# EAGLE design ball-r1 (EAGLE 5.12)
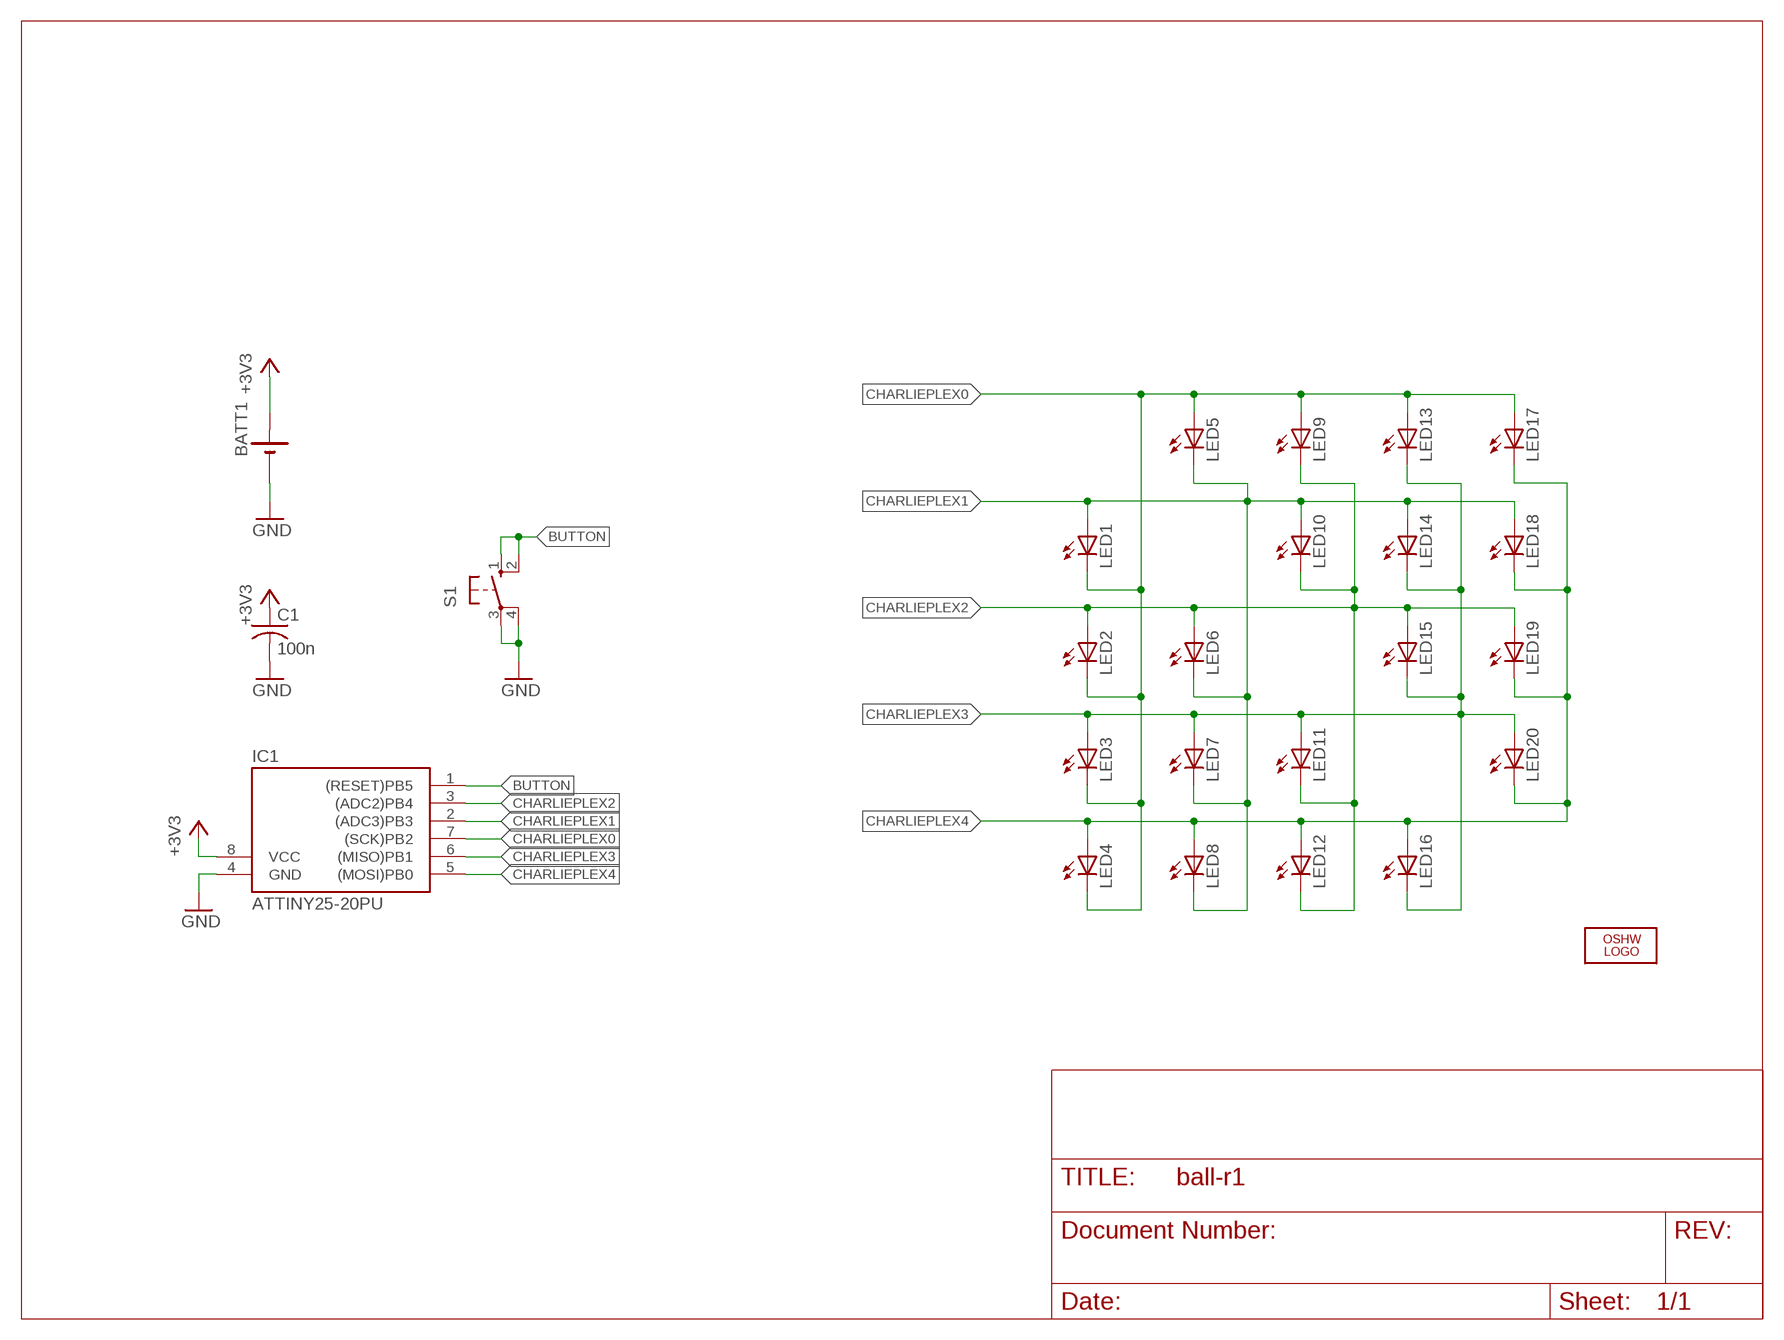
[diagram p0: schematic, sheet 1]

## Parts
BATT1  2032SMD  [2032SMD]
C1  100n  C-US050-025X075  [C050-025X075]
IC1  ATTINY25-20PU  TINY138P3  [DIL08]
LED1  LED3MM  [LED3MM]
LED2  LED3MM  [LED3MM]
LED3  LED3MM  [LED3MM]
LED4  LED3MM  [LED3MM]
LED5  LED3MM  [LED3MM]
LED6  LED3MM  [LED3MM]
LED7  LED3MM  [LED3MM]
LED8  LED3MM  [LED3MM]
LED9  LED3MM  [LED3MM]
LED10  LED3MM  [LED3MM]
LED11  LED3MM  [LED3MM]
LED12  LED3MM  [LED3MM]
LED13  LED3MM  [LED3MM]
LED14  LED3MM  [LED3MM]
LED15  LED3MM  [LED3MM]
LED16  LED3MM  [LED3MM]
LED17  LED3MM  [LED3MM]
LED18  LED3MM  [LED3MM]
LED19  LED3MM  [LED3MM]
LED20  LED3MM  [LED3MM]
LOGO1  OSHW_LOGO_FILLX0100-NT  [OSHW_FILLX100_NOTEXT]
S1  10-XX  [B3F-10XX]

## Nets
+3V3: BATT1.+ C1.1 IC1.8(VCC)
BUTTON: IC1.1((RESET)PB5) S1.1(S) S1.2(S1)
CHARLIEPLEX0: IC1.7((SCK)PB2) LED1.K(C) LED2.K(C) LED3.K(C) LED4.K(C) LED5.A LED9.A LED13.A LED17.A
CHARLIEPLEX1: IC1.2((ADC3)PB3) LED1.A LED5.K(C) LED6.K(C) LED7.K(C) LED8.K(C) LED10.A LED14.A LED18.A
CHARLIEPLEX2: IC1.3((ADC2)PB4) LED2.A LED6.A LED9.K(C) LED10.K(C) LED11.K(C) LED12.K(C) LED15.A LED19.A
CHARLIEPLEX3: IC1.6((MISO)PB1) LED3.A LED7.A LED11.A LED13.K(C) LED14.K(C) LED15.K(C) LED16.K(C) LED20.A
CHARLIEPLEX4: IC1.5((MOSI)PB0) LED4.A LED8.A LED12.A LED16.A LED17.K(C) LED18.K(C) LED19.K(C) LED20.K(C)
GND: BATT1.- C1.2 IC1.4(GND) S1.3(P) S1.4(P1)

## Library data of the parts
BATT1 = rbg-4ucon-battery:2032SMD
C1 = rcl:C-US: CAPACITOR, American symbol
IC1 = avr-5:TINY13*
LED1-LED20 = led:LED: LED OSRAM: - CHIPLED LG R971, LG N971, LY N971, LG Q971, LY Q971, LO R971, LY R971 LH N974, LH R974 LS Q976, LO Q976, LY Q976 LO Q996 - Hyper CHIPLED LW Q18S LB Q993, LB Q99A, LB R99A - SideLED LS A670, LO A670, LY A670, LG A670, LP A670 LB A673, LV A673, LT A673, LW A673 LH A674 LY A675 LS A676, LA A676, LO A676, LY A676, LW A676 LS A679, LY A679, LG A679 - Hyper Micro SIDELED® LS Y876, LA Y876, LO Y876, LY Y876 LT Y87S - SmartLED LW L88C, LW L88S LB L89C, LB L89S, LG L890 LS L89K, LO L89K, LY L89K LS L896, LA L896, LO L896, LY L896 - TOPLED LS T670, LO T670, LY T670, LG T670, LP T670 LSG T670, LSP T670, LSY T670, LOP T670, LYG T670 LG T671, LOG T671, LSG T671 LB T673, LV T673, LT T673, LW T673 LH T674 LS T676, LA T676, LO T676, LY T676, LB T676, LH T676, LSB T676, LW T676 LB T67C, LV T67C, LT T67C, LS T67K, LO T67K, LY T67K, LW E67C LS E67B, LA E67B, LO E67B, LY E67B, LB E67C, LV E67C, LT E67C LW T67C LS T679, LY T679, LG T679 LS T770, LO T770, LY T770, LG T770, LP T770 LB T773, LV T773, LT T773, LW T773 LH T774 LS E675, LA E675, LY E675, LS T675 LS T776, LA T776, LO T776, LY T776, LB T776 LHGB T686 LT T68C, LB T68C - Hyper Mini TOPLED® LB M676 - Mini TOPLED Santana® LG M470 LS M47K, LO M47K, LY M47K Source: http://www.osram.convergy.de LUXEON: - LUMILED® LXK2-PW12-R00, LXK2-PW12-S00, LXK2-PW14-U00, LXK2-PW14-V00 LXK2-PM12-R00, LXK2-PM12-S00, LXK2-PM14-U00 LXK2-PE12-Q00, LXK2-PE12-R00, LXK2-PE12-S00, LXK2-PE14-T00, LXK2-PE14-U00 LXK2-PB12-K00, LXK2-PB12-L00, LXK2-PB12-M00, LXK2-PB14-N00, LXK2-PB14-P00, LXK2-PB14-Q00 LXK2-PR12-L00, LXK2-PR12-M00, LXK2-PR14-Q00, LXK2-PR14-R00 LXK2-PD12-Q00, LXK2-PD12-R00, LXK2-PD12-S00 LXK2-PH12-R00, LXK2-PH12-S00 LXK2-PL12-P00, LXK2-PL12-Q00, LXK2-PL12-R00 Source: www.luxeon.com KINGBRIGHT: KA-3528ASYC Source: www.kingbright.com
LOGO1 = ohw-logo:OSHW_LOGO_FILL
S1 = rbg-generic-tact-switch:10-XX: OMRON SWITCH

## Board
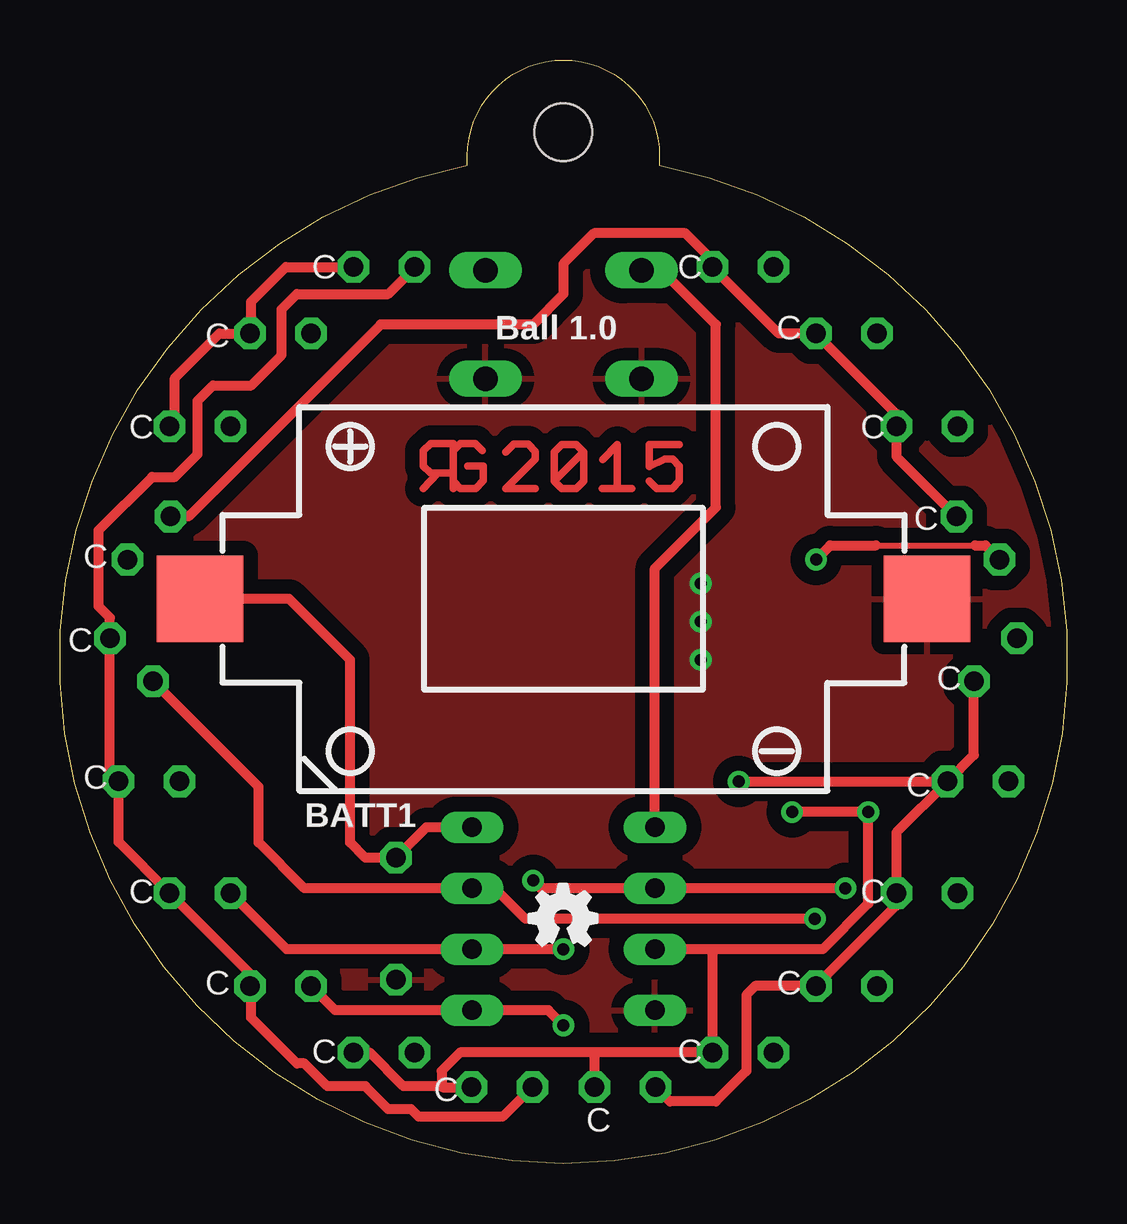
[diagram p1: board, top side]
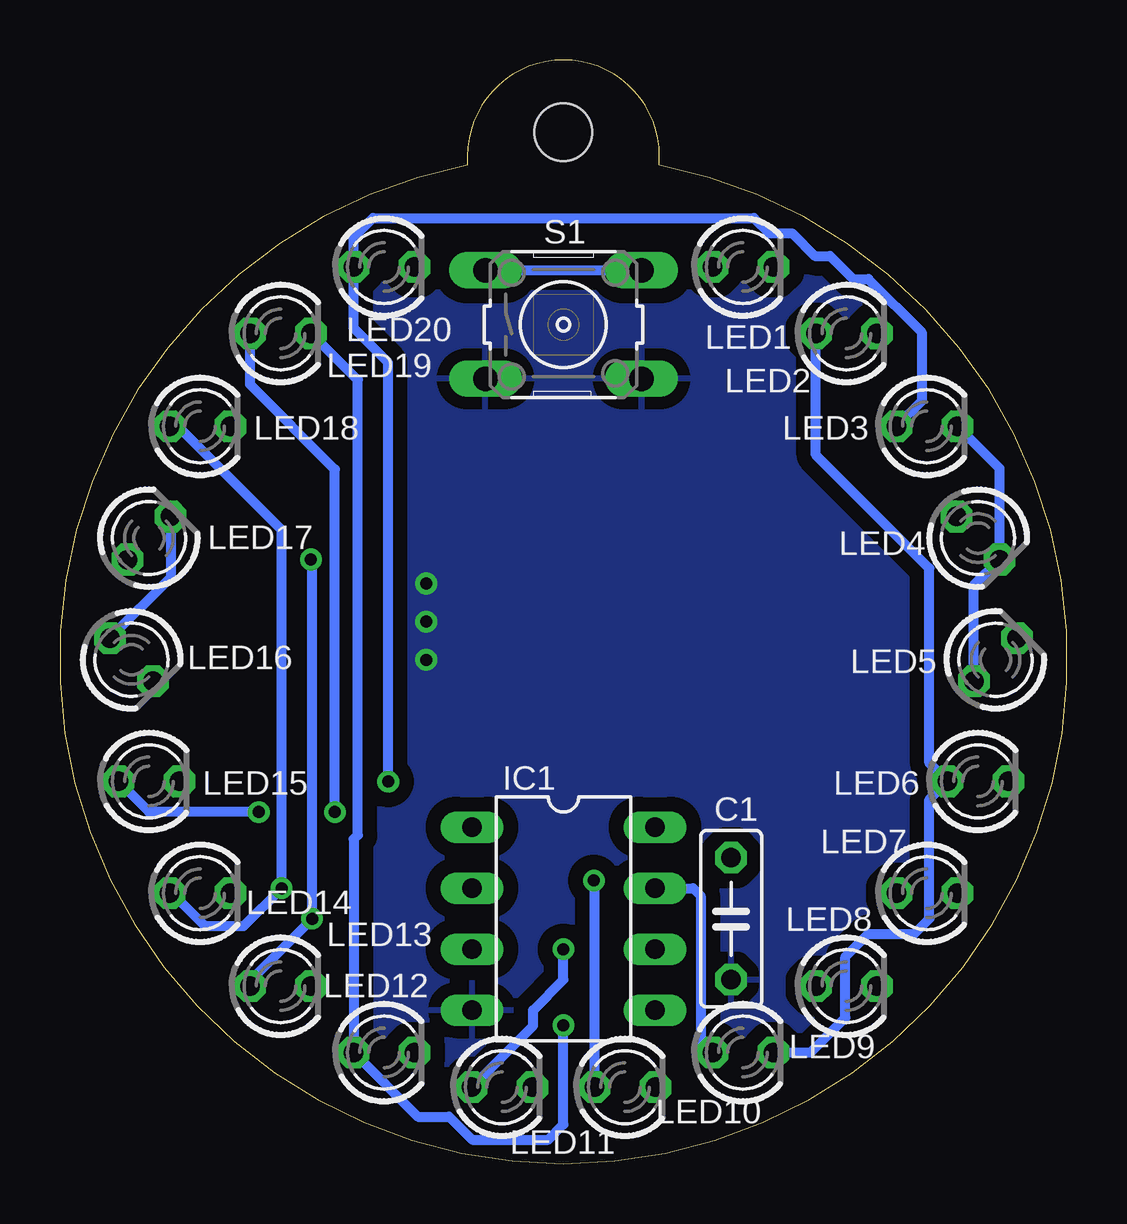
[diagram p2: board, bottom side, seen from below]

Size 41.96 x 46 mm. Coordinates in mm from the lower left corner, seen from the top.
Outline: 24.98,41.62 arc-338 16.98,41.62 16.98,42 arc-90 20.98,46 arc-90 24.98,42 24.98,41.62
Copper layers (1*16): Top 0.035mm / dielectric 1.5mm / Bottom 0.035mm
Design rules "default *": minimum track width 10mil, minimum drill 0.5mm, track to track 10mil, track to pad 10mil, pad to pad 10mil, via to via 10mil, smd to smd 10mil, copper to edge 10mil, drill to drill 8mil, minimum pad ring 10mil, minimum via ring 8mil, stop-mask expansion 4mil, vias tented up to drill 20mil, thermal gap 20mil
Holes 2.4 mm at 20.98,43

### Footprints (pad centres in the part's own frame; a part is rotated, then mirrored left to right if it is on the bottom)
2032SMD = smd 3.6 x 3.6: + -15.15,0; - 15.15,0
C050-025X075 = drill 0.813 octagon: 1 -2.54,0; 2 2.54,0
DIL08 = drill 0.813 long: 1 -3.81,-3.81; 2 -1.27,-3.81; 3 1.27,-3.81; 4 3.81,-3.81; 5 3.81,3.81; 6 1.27,3.81; 7 -1.27,3.81; 8 -3.81,3.81
LED3MM = drill 0.813 octagon: A -1.27,0; K 1.27,0
B3F-10XX = drill 1.016 long: 1 -3.251,2.261; 2 3.251,2.261; 3 -3.251,-2.261; 4 3.251,-2.261

### Placement (x,y rotation side)
BATT1  20.98,23.54 0 top
C1  13.99,10.21 270 bottom
IC1  20.98,10.21 270 bottom
LED1  13.5,37.37 0 bottom
LED2  9.19,34.6 0 bottom
LED3  5.84,30.73 0 bottom
LED4  3.71,26.07 315 bottom
LED5  2.98,21 45 bottom
LED6  3.71,15.93 0 bottom
LED7  5.84,11.27 0 bottom
LED8  9.19,7.4 0 bottom
LED9  13.5,4.63 0 bottom
LED10  18.42,3.18 0 bottom
LED11  23.54,3.18 0 bottom
LED12  28.46,4.63 0 bottom
LED13  32.77,7.4 0 bottom
LED14  36.12,11.27 0 bottom
LED15  38.25,15.93 0 bottom
LED16  38.98,21 315 bottom
LED17  38.25,26.07 45 bottom
LED18  36.12,30.73 0 bottom
LED19  32.77,34.6 0 bottom
LED20  28.46,37.37 0 bottom
LOGO1  19.55,9.09 0 top
S1  20.98,34.97 0 bottom
U$2  [RGLOGO_SMALL_2015]  16.53,27.99 0 top

### Tracks (layer width: path | path; a pad name or v marks a point on that pad's centre or on a via)
+3V3
  Top 0.406: IC1.8 15.26,14.02 C1.1 12.72,12.75 12.09,13.38 12.09,21 9.55,23.54 BATT1.+
BUTTON
  Top 0.406: IC1.1 24.79,24.81 27.33,27.35 27.33,34.97 24.79,37.51 24.51,37.51 S1.1
  Bottom 0.406: S1.1 S1.2
CHARLIEPLEX0  (via drill 0.5)
  Top 0.254: 34,25.76 38.12,25.76
  Top 0.406: LED5.A 8.28,15.7 8.28,13.38 10.18,11.48 IC1.7 18.12,11.48 19.39,10.21 v31.46,10.21 | LED1.K 9.41,37.37 7.96,35.92 7.96,34.64 LED2.K 6.64,34.6 4.79,32.75 4.79,30.95 LED3.K | v31.5,25.17 32.09,25.76 34,25.76 | LED17.A 38.56,25.76 38.12,25.76
  Bottom 0.406: LED3.K 2.81,28.98 LED4.K 3.88,24.11 LED5.A | IC1.7 15.58,11.48 15.26,11.16 15.26,5.12 LED9.A | LED13.A 34.04,7.63 v31.46,10.21 31.46,25.13 v31.5,25.17
CHARLIEPLEX1  (via drill 0.5)
  Top 0.406: LED10.A 19.67,3.18 18.44,1.95 14.95,1.95 14.63,2.27 13.68,2.27 12.72,3.22 11.14,3.22 10.18,4.17 9.87,4.17 7.96,6.08 7.96,7.36 LED8.K 7.92,7.91 LED7.K 2.44,13.4 LED6.K 2.08,16.29 LED5.K 2.08,22.75 1.61,23.22 1.61,26.4 3.83,28.62 4.79,28.62 5.74,29.57 5.74,31.8 6.37,32.43 7.96,32.43 9.23,33.7 9.23,35.61 9.87,36.24 13.68,36.24 14.77,37.34 LED1.A | v19.71,11.79 20.03,11.48 20.34,11.48 IC1.2 v32.73,11.48
  Bottom 0.406: LED10.A 19.69,11.77 v19.71,11.79 | LED14.A 37.28,11.27 35.9,9.89 34.31,9.89 v32.73,11.48 32.73,26.4 37.06,30.73 LED18.A
CHARLIEPLEX2  (via drill 0.5)
  Top 0.406: 22.25,4.63 LED12.K 27.19,8.79 27.33,8.94 | 22.25,4.63 16.67,4.63 15.9,3.86 15.9,3.22 | LED10.K 15.94,3.18 15.9,3.22 | LED11.K 22.27,4.61 22.25,4.63 | LED9.K 12.9,4.63 14.31,3.22 15.9,3.22 | v30.5,14.65 v33.68,14.65 33.68,10.84 31.77,8.94 27.33,8.94 | 27.33,8.94 IC1.3
  Bottom 0.406: LED9.K 10.68,4.63 9.23,6.08 9.23,8.62 8.28,9.57 6.37,9.57 5.74,10.21 5.74,15.17 LED6.A 5.74,16.69 5.74,24.81 10.46,29.53 LED2.A | v33.68,14.65 38.24,14.65 LED15.A | LED19.A 34.04,32.47 30.5,28.94 v30.5,14.65
CHARLIEPLEX3  (via drill 0.5)
  Top 0.406: LED16.K 38.08,17.03 LED15.K | LED15.K 34.85,13.8 LED14.K 34.85,10.75 LED13.K 28.97,7.4 28.6,7.03 28.6,3.86 27.33,2.59 25.41,2.59 LED11.A | LED7.A 9.44,8.94 IC1.6 v20.98,8.94 | v28.28,15.92 LED15.K
  Bottom 0.406: LED3.A 6.06,31.78 6.06,34.65 8.28,36.88 8.91,36.88 9.87,37.83 10.5,37.83 11.45,38.78 12.41,38.78 13.04,39.42 28.92,39.42 29.73,38.61 LED20.A 29.73,34.83 28.28,33.38 v28.28,15.92 | v20.98,8.94 20.98,7.67 22.25,6.4 22.25,5.75 LED11.A
CHARLIEPLEX4  (via drill 0.5)
  Top 0.406: LED4.A 5.36,26.97 13.36,34.97 19.71,34.97 20.98,36.24 20.98,37.51 22.25,38.78 26.06,38.78 27.33,37.51 27.32,37.51 LED20.K 29.96,34.6 LED19.K 34.85,31.25 LED18.K 34.85,29.47 LED17.K | LED8.A 11.46,6.4 IC1.5 20.34,6.4 v20.98,5.76
  Bottom 0.406: LED17.K 37.35,24.42 LED16.A | v20.98,5.76 20.98,1.63 21.61,1 24.79,1 25.74,1.95 27.05,1.95 LED12.A 29.73,13.52 29.55,13.7 29.55,32.66 LED19.K
GND  (via drill 0.5)
  other vias: 26.69,24.18 26.69,22.59 26.69,21
  pour Bottom (isolate 0.61): 47.01,47.04 -5.06,47.04 -5.06,-5.03 47.01,-5.03
  pour Top (isolate 0.61): 47.01,47.04 -5.06,47.04 -5.06,-5.03 47.01,-5.03

### Text on the board
tPlace: C | C | C | Ball 1.0 | C | C | C | C | C | C | C | C | C | C | C | C | C | C | C | C | C